# Altium project KC_BaseBoard4CompareTest-V0.1_NT_MIRR.PrjPcb
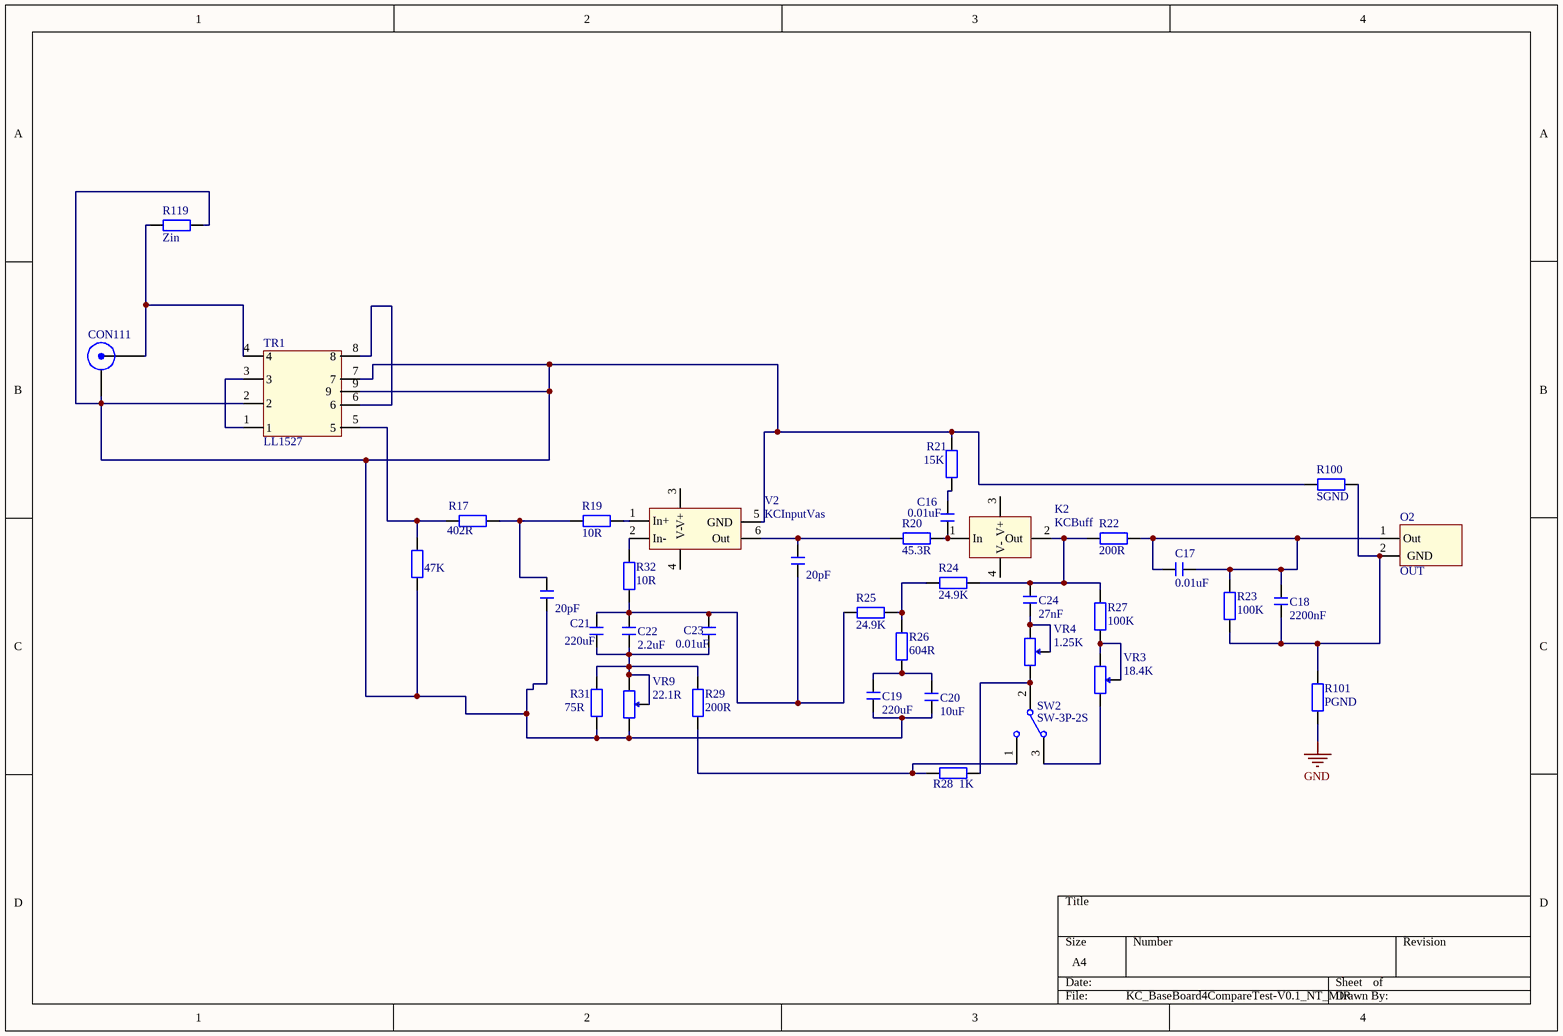
[diagram p0: KC_BaseBoard4CompareTest-V0.1_NT_MIRR.SchDoc]
1 sheet, 38 parts. Net scope: global (net labels, ports and power ports of the same name join across sheets).
Board file: KC_BaseBoard4CompareTest-V0.1_NT_MIRR.PcbDoc

## Sheet KC_BaseBoard4CompareTest-V0.1_NT_MIRR.SchDoc
size A4

### Parts
C16  0.01uF  [CBB 6.3*6.3*5]
C17  0.01uF  [CBB 6.3*6.3*5]
C18  2200nF  [CBB 6.3*6.3*5]
C19  220uF  [CAP 5.0*12.5*20]
C20  10uF  [CBB 6.3*6.3*5]
C21  220uF  [CAP 5.0*12.5*20]
C22  2.2uF  [CBB 6.3*6.3*5]
C23  0.01uF  [CBB 6.3*6.3*5]
C24  27nF  [CBB 6.3*6.3*5]
C303  20pF  [CBB 6.3*6.3*5]
C403  20pF  [CBB 6.3*6.3*5]
CON111  RCA  [RCA-Wire]  (value not drawn)
K2  KCBuff  [KCBuff_M4]
O2  OUT  [Signal_Terminal]
R17  402R  [RS 1/4W]
R19  10R  [RS 1/4W]
R20  45.3R  [RS 1/4W]
R21  15K  [RS 1/4W]
R22  200R  [RS 1/4W]
R23  100K  [RS 1/4W]
R24  24.9K  [RS 1/4W]
R25  24.9K  [RS 1/4W]
R26  604R  [RS 1/4W]
R27  100K  [RS 1/4W]
R28  1K  [RS 1/4W]
R29  200R  [RS 1/4W]
R31  75R  [RS 1/4W]
R32  10R  [RS 1/4W]
R100  SGND  [RS 1/4W]
R101  PGND  [RS 1/4W]
R119  Zin  [RS 1/4W]
R183  47K  [RS 1/4W]
SW2  SW-3P-2S  [SS-12D06]
TR1  LL1527  [LL1527]
V2  KCInputVas  [KCIn_VAS_M4]
VR3  18.4K  [RS 1/2W-VR]
VR4  1.25K  [RS 1/2W-VR]
VR9  22.1R  [RS 1/2W-VR]

### Nets
GND: R101.1
NetC16_1: C16.1 K2.1(In) R20.2
NetC16_2: C16.2 R21.1
NetC17_1: C17.1 C17.2 C18.1 O2.1(Out) R22.1 R23.1
NetC18_2: C18.2 O2.2(GND) R23.2 R100.2 R101.2
NetC19_1: C19.1 C20.1 R26.1
NetC19_2: C19.2 C20.2 C303.1 CON111.2(Y) R21.2 R31.1 R100.1 R119.2 R183.1 TR1.2 TR1.7 TR1.9 V2.5(GND) VR9.2
NetC21_1: C21.1 C22.1 C23.1 C403.1 R25.1 R32.1
NetC21_2: C21.2 C22.2 C23.2 R29.2 R31.2 VR9.1 VR9.3
NetC24_1: C24.1 K2.2(Out) R22.2 R24.2 R27.1
NetC24_2: C24.2 VR4.1 VR4.3
NetC303_2: C303.2 R17.2 R19.1
NetC403_2: C403.2 R20.1 V2.6(Out)
NetCON111_1: CON111.1(X) R119.1 TR1.4
NetR17_1: R17.1 R183.2 TR1.5
NetR19_2: R19.2 V2.1(In+)
NetR24_1: R24.1 R25.2 R26.2
NetR27_2: R27.2 VR3.1 VR3.3
NetR28_1: R28.1 R29.1 SW2.1
NetR28_2: R28.2 SW2.2 VR4.2
NetR32_2: R32.2 V2.2(In-)
NetSW2_3: SW2.3 VR3.2
NetTR1_1: TR1.1 TR1.3
NetTR1_6: TR1.6 TR1.8

Not connected (* = marked no-connect by the designer): K2 3(V+) 4(V-); V2 3(V+) 4(V-)

### Library data of the parts
C16-C24 C303 C403 = C-CBB: CBB电容; 版权归属: 源创客; BOM名称: CBB电容; 学习资源: www.ooocke.com
CON111 = RCA: RCA Connector; Revision: 17-Jul-2002: Re-released for DXP Platform.; Publisher: Altium Limited
K2 = KCBuff: King Cello Buffer Stage
O2 = Signal_Out: Signal Out
R17 R19-R29 R31 R32 R100 R101 R119 R183 = R-CRR: 直插色环电阻; BOM名称: 色环电阻; 版权归属: 源创客; 学习资源: www.ooocke.com
SW2 = SW-3P-2S: 3 Pin 2 Switch
TR1 = LL1527: Lundahl LL1527
V2 = KCInputVas: King Cello Input Stage and VAS
VR3 VR4 VR9 = VR-W: 直插可调电阻-顶调